# EAGLE design 16x2LCDShield (EAGLE 5.10)
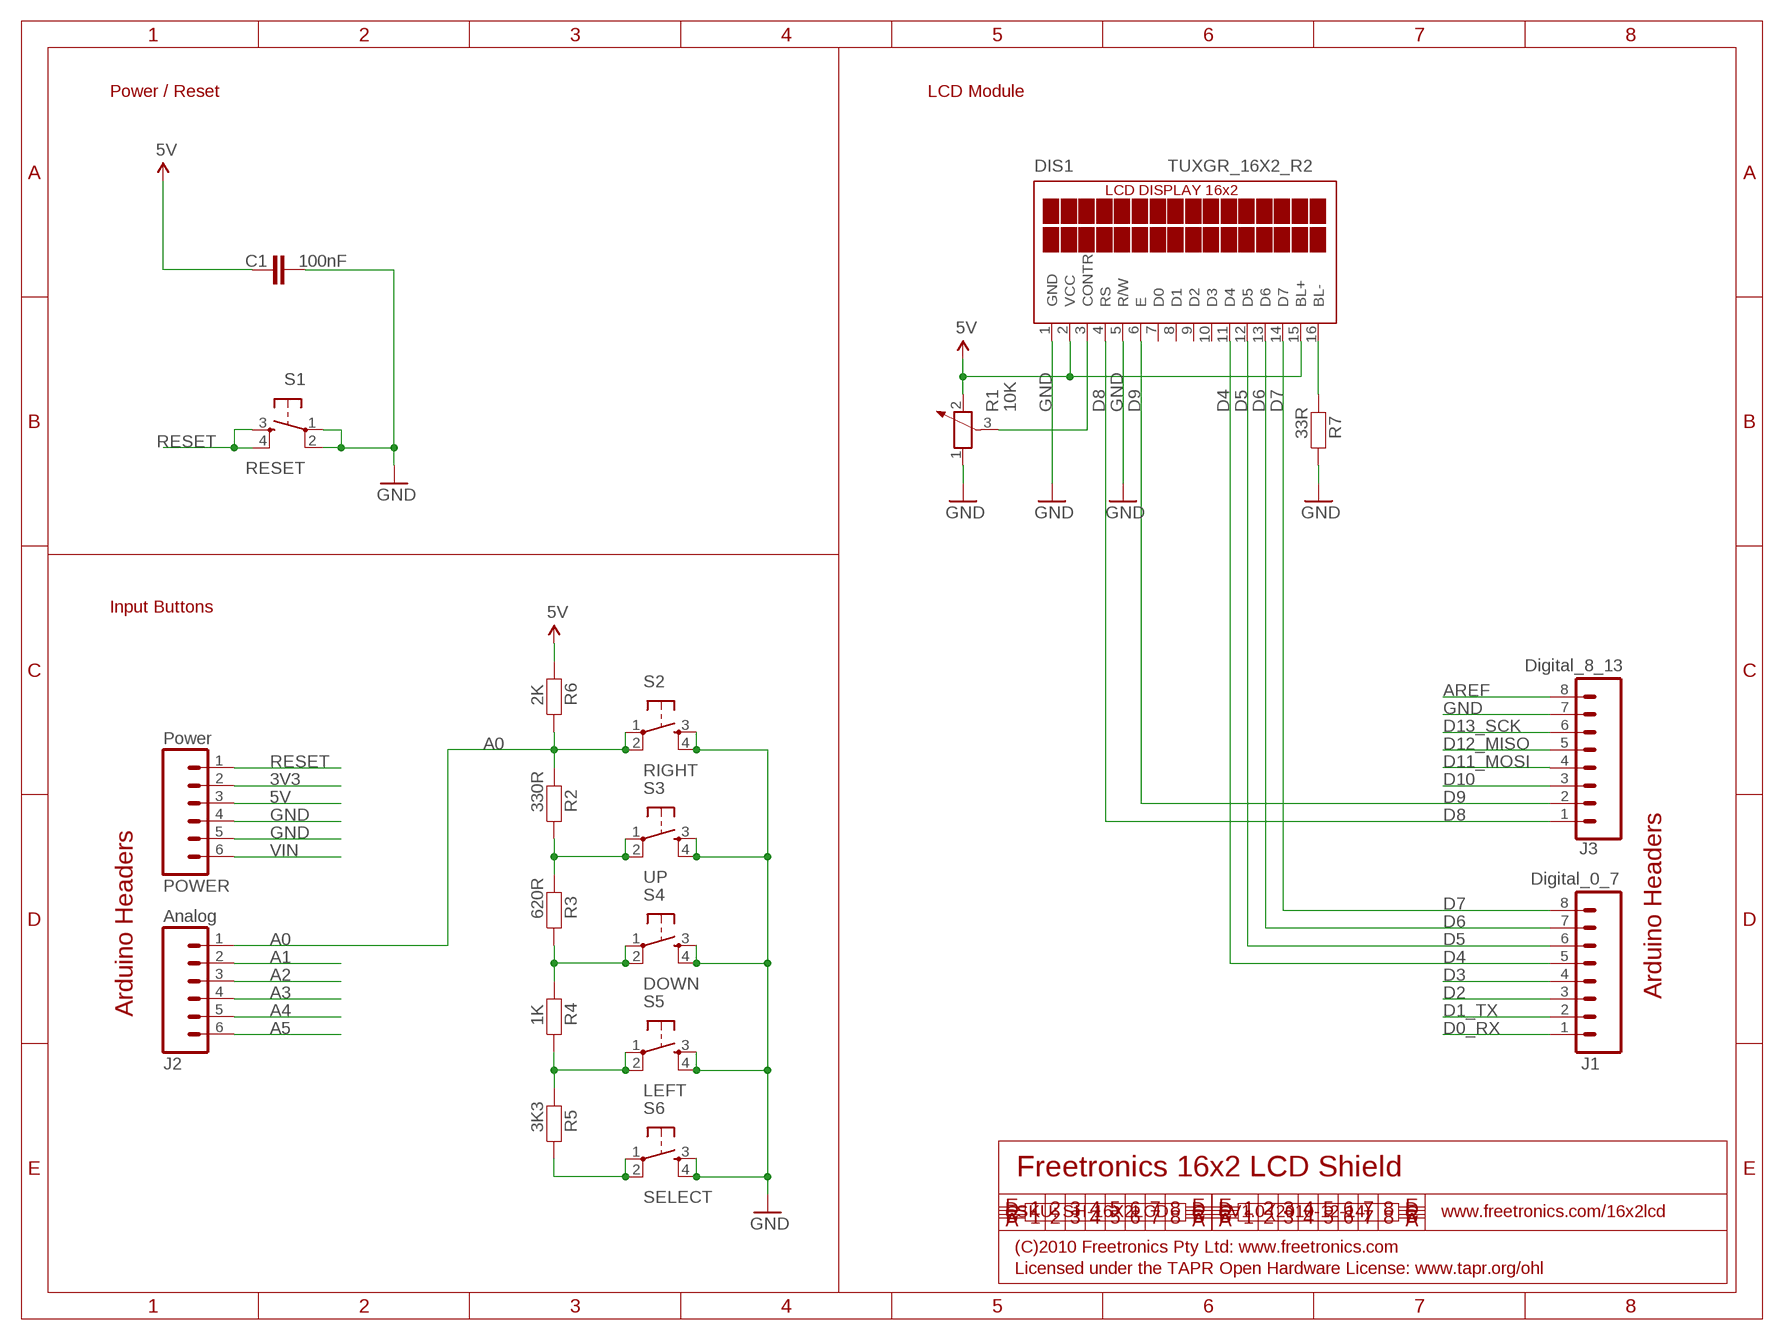
[diagram p0: schematic, sheet 1]

## Parts
C1  100nF  CAPPTH  [CAP-PTH-SMALL]
DIS1  TUXGR_16X2_R2  [TUXGR_16X2_R2]
J1  Digital_0_7  M08  [1X08]
J2  Analog  M06SIP  [1X06]
J3  Digital_8_13  M08  [1X08]
POWER  Power  M06SIP  [1X06]
R1  10K  POTENTIOMETER_PT-10  [PT-10]
R2  330R  FREETRONICS_RESISTORPTH2  [FREETRONICS_AXIAL-0.4]
R3  620R  FREETRONICS_RESISTORPTH2  [FREETRONICS_AXIAL-0.4]
R4  1K  FREETRONICS_RESISTORPTH2  [FREETRONICS_AXIAL-0.4]
R5  3K3  FREETRONICS_RESISTORPTH2  [FREETRONICS_AXIAL-0.4]
R6  2K  FREETRONICS_RESISTORPTH2  [FREETRONICS_AXIAL-0.4]
R7  33R  FREETRONICS_RESISTORPTH2  [FREETRONICS_AXIAL-0.4]
S1  RESET  TAC_SWITCHPTH  [TACTILE-PTH]
S2  RIGHT  TAC_SWITCHPTH  [TACTILE-PTH]
S3  UP  TAC_SWITCHPTH  [TACTILE-PTH]
S4  DOWN  TAC_SWITCHPTH  [TACTILE-PTH]
S5  LEFT  TAC_SWITCHPTH  [TACTILE-PTH]
S6  SELECT  TAC_SWITCHPTH  [TACTILE-PTH]

## Nets
3V3: POWER.2
5V: C1.1 DIS1.2(VCC) DIS1.15(BL+) POWER.3 R1.2 R6.P$2
A0: J2.1 R2.P$2 R6.P$1 S2.1 S2.2
A1: J2.2
A2: J2.3
A3: J2.4
A4: J2.5
A5: J2.6
AREF: J3.8
D0_RX: J1.1
D1_TX: J1.2
D2: J1.3
D3: J1.4
D4: DIS1.11(D4) J1.5
D5: DIS1.12(D5) J1.6
D6: DIS1.13(D6) J1.7
D7: DIS1.14(D7) J1.8
D8: DIS1.4(RS) J3.1
D9: DIS1.6(E) J3.2
D10: J3.3
D11_MOSI: J3.4
D12_MISO: J3.5
D13_SCK: J3.6
GND: C1.2 DIS1.1(GND) DIS1.5(R/W) J3.7 POWER.4 POWER.5 R1.1 R7.P$1 S1.1 S1.2 S2.3 S2.4 S3.3 S3.4 S4.3 S4.4 S5.3 S5.4 S6.3 S6.4
N$1: DIS1.3(CONTR) R1.3
N$2: R5.P$1 S6.1 S6.2
N$3: R4.P$1 R5.P$2 S5.1 S5.2
N$4: DIS1.16(BL-) R7.P$2
N$248: R3.P$1 R4.P$2 S4.1 S4.2
N$250: R2.P$1 R3.P$2 S3.1 S3.2
RESET: POWER.1 S1.3 S1.4
VIN: POWER.6
Unconnected: DIS1.7(D0) DIS1.8(D1) DIS1.9(D2) DIS1.10(D3)

## Notes on the sheet
- Power / Reset | LCD Module
- Input Buttons
- Arduino Headers
- Arduino Headers
- Freetronics 16x2 LCD Shield
- SKU: SH-16X2LCD | V1.0 (2010-12-14) | www.freetronics.com/16x2lcd
- (C)2010 Freetronics Pty Ltd: www.freetronics.com
- Licensed under the TAPR Open Hardware License: www.tapr.org/ohl

## Library data of the parts
C1 = freetronics:CAP: Capacitor Standard 0603 ceramic capacitor, and 0.1" leaded capacitor.
DIS1 = freetronics-jon:TUXGR_16X2_R2: Tuxgraphics LCD display 16x2 characters reflective, without background light Source: tuxgr_12x2_r2.pdf
J1 J3 = freetronics:M08: Header 8 Standard 8-pin 0.1" header. Use with straight break away headers (SKU : PRT-00116), right angle break away headers (PRT-00553), swiss pins (PRT-00743), machine pins (PRT-00117), and female headers (PRT-00115).
J2 POWER = freetronics:M06: Header 6 Standard 6-pin 0.1" header. Use with straight break away headers (SKU : PRT-00116), right angle break away headers (PRT-00553), swiss pins (PRT-00743), machine pins (PRT-00117), and female headers (PRT-00115). Molex polarized connector foot print use with SKU : PRT-08094 with associated crimp pins and housings. NOTES ON THE VARIANTS LOCK and LOCK_LONGPADS... This footprint was designed to help hold the alignment of a through-hole component (i.e. 6-pin header) while soldering it into place. You may notice that each hole has been shifted either up or down by 0.005 of an inch from it's more standard position (which is a perfectly straight line). This slight alteration caused the pins (the squares in the middle) to touch the edges of the holes. Because they are alternating, it causes a "brace" to hold the component in place. 0.005 has proven to be the perfect amount of "off-center" position when using our standard breakaway headers. Although looks a little odd when you look at the bare footprint, once you have a header in there, the alteration is very hard to notice. Also, if you push a header all the way into place, it is covered up entirely on the bottom side. This idea of altering the position of holes to aid alignment will be further integrated into the Sparkfun Library for other footprints. It can help hold any component with 3 or more connection pins.
R1 = rcl:POTENTIOMETER_: Potentiometer
R2-R7 = freetronics:FREETRONICS_RESISTOR: Resistor Basic schematic elements and footprints for 0603, 1206, and PTH 1/10th watt (small) resistors.
S1-S6 = freetronics:TAC_SWITCH: Momentary Switch Button commonly used for reset or general input. Spark Fun Electronics SKU : COM-00097

## Board
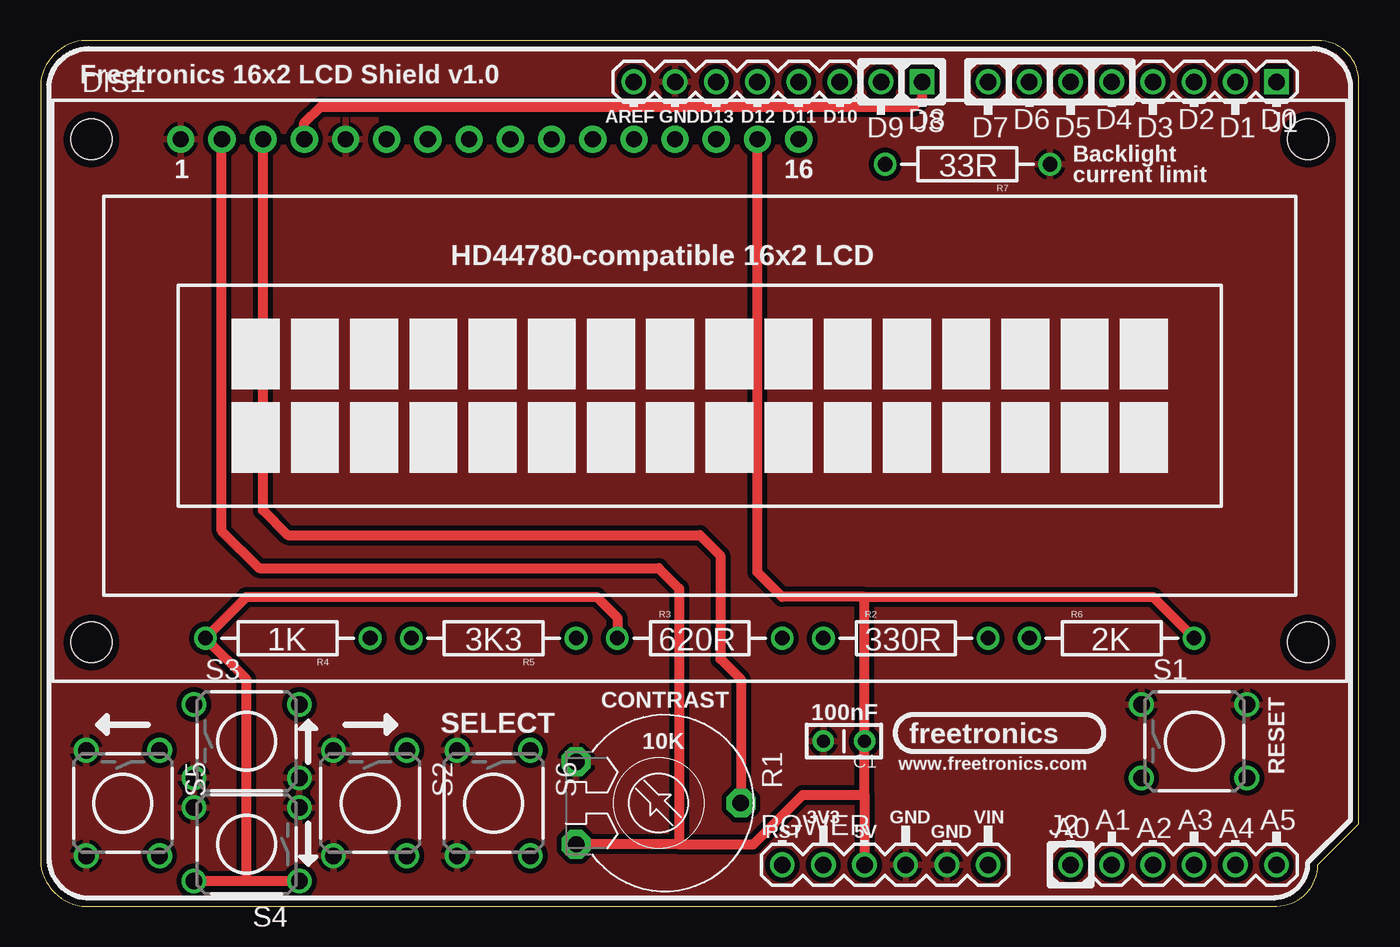
[diagram p1: board, top side]
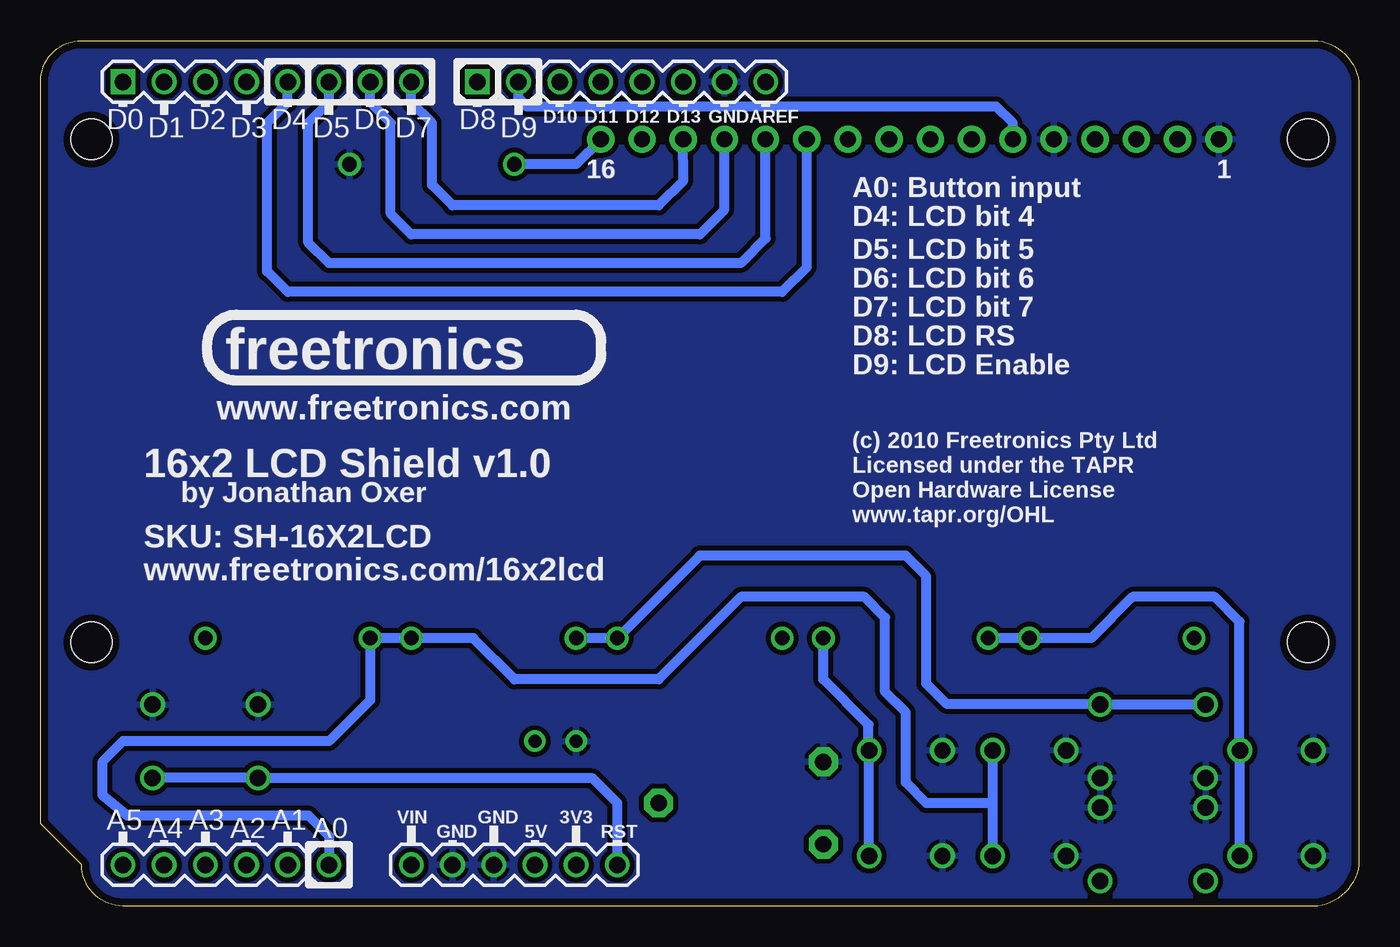
[diagram p2: board, bottom side, seen from below]

Size 81.28 x 53.34 mm. Coordinates in mm from the lower left corner, seen from the top.
Outline: 0,2.54 arc74 2.54,0 76.2,0 arc90 78.74,2.54 81.28,5.08 81.28,50.8 arc90 78.74,53.34 2.54,53.34 arc74 0,50.8 0,2.54
Copper layers (1*16): Top 0.035mm / dielectric 1.5mm / Bottom 0.035mm
Design rules "default *": minimum track width 10mil, minimum drill 24mil, track to track 12mil, track to pad 12mil, pad to pad 12mil, via to via 12mil, smd to smd 8mil, copper to edge 18mil, drill to drill 8mil, minimum pad ring 10mil, minimum via ring 8mil, stop-mask expansion 4mil, vias tented up to drill 0mil, thermal gap 10mil

### Footprints (pad centres in the part's own frame; a part is rotated, then mirrored left to right if it is on the bottom)
CAP-PTH-SMALL = drill 0.813 round: 1 0,0; 2 2.54,0
TUXGR_16X2_R2 = drill 1 pad 1.676 round: 1 -32,15.5; 2 -29.46,15.5; 3 -26.92,15.5; 4 -24.38,15.5; 5 -21.84,15.5; 6 -19.3,15.5; 7 -16.76,15.5; 8 -14.22,15.5; 9 -11.68,15.5; 10 -9.14,15.5; 11 -6.6,15.5; 12 -4.06,15.5; 13 -1.52,15.5; 14 1.02,15.5; 15 3.56,15.5; 16 6.1,15.5 | hole 2.5: -37.5,-15.5; 37.5,-15.5; -37.5,15.5; 37.5,15.5
1X08 = drill 1.016 square: 1 0,0 | drill 1.016 round: 2 2.54,0; 3 5.08,0; 4 7.62,0; 5 10.16,0; 6 12.7,0; 7 15.24,0; 8 17.78,0
1X06 = drill 1.016 round: 1 0,0; 2 2.54,0; 3 5.08,0; 4 7.62,0; 5 10.16,0; 6 12.7,0
PT-10 = drill 1.016 pad 1.778 octagon: 1 -2.54,-5.08; 2 2.54,-5.08; 3 0,5.08
FREETRONICS_AXIAL-0.4 = drill 0.9 round: P$1 -5.08,0; P$2 5.08,0
TACTILE-PTH = drill 1.016 round: 1 -3.251,2.261; 2 3.251,2.261; 3 -3.251,-2.261; 4 3.251,-2.261

### Placement (x,y rotation side)
C1  50.8,10.16 180 top
DIS1  40.64,31.75 0 top
J1  76.2,50.8 180 top
J2  63.5,2.54 0 top
J3  54.36,50.8 180 top
POWER  45.72,2.54 0 top
R1  38.1,6.35 270 top
R2  53.34,16.51 0 top
R3  40.64,16.51 0 top
R4  15.24,16.51 180 top
R5  27.94,16.51 180 top
R6  66.04,16.51 0 top
R7  57.15,45.72 180 top
S1  71.12,10.16 0 top
S2  20.32,6.35 270 top
S3  12.7,10.16 0 top
S4  12.7,3.81 180 top
S5  5.08,6.35 270 top
S6  27.94,6.35 270 top

### Tracks (layer width: path | path; a pad name or v marks a point on that pad's centre or on a via)
5V
  Top 0.406: DIS1.2
  Top 0.61: 50.8,19.05 C1.1 50.8,6.86 | 50.8,19.05 68.58,19.05 R6.P$2 | 50.8,19.05 45.72,19.05 44.2,20.57 44.2,21.84 DIS1.15 | 39.37,3.81 R1.2 | 39.37,3.81 43.94,3.81 46.99,6.86 50.8,6.86 | DIS1.2 11.18,23.11 13.46,20.83 38.1,20.83 39.37,19.56 39.37,3.81 | 50.8,6.86 POWER.3
A0
  Bottom 0.61: S2.2 22.58,6.35 | 22.58,6.35 S2.1 | 22.58,6.35 26.67,6.35 27.94,7.62 27.94,11.94 29.21,13.21 29.21,17.78 30.48,19.05 38.1,19.05 43.18,13.97 52.07,13.97 54.61,16.51 R2.P$2 R6.P$1 60.96,12.7 63.5,10.16 76.2,10.16 77.47,8.89 77.47,6.86 75.95,5.59 64.77,5.59 63.5,4.32 J2.1
D4
  Bottom 0.61: J1.5 66.04,49.53 67.31,48.26 67.31,39.12 66.04,37.85 35.56,37.85 34.04,39.37 DIS1.11
D5
  Bottom 0.61: J1.6 63.5,49.53 64.77,48.26 64.77,40.89 63.5,39.62 38.1,39.62 36.58,41.15 DIS1.12
D6
  Bottom 0.61: J1.7 60.96,49.53 59.69,48.26 59.69,42.67 58.42,41.4 40.64,41.4 39.12,42.93 DIS1.13
D7
  Bottom 0.61: J1.8 58.42,49.53 57.15,48.26 57.15,44.45 55.88,43.18 43.18,43.18 41.66,44.7 DIS1.14
D8
  Top 0.61: DIS1.4 16.26,48.26 17.27,49.28 53.85,49.28 54.36,49.78 J3.1
D9
  Bottom 0.61: DIS1.6 21.34,48.26 22.35,49.28 51.31,49.28 51.82,49.78 J3.2
GND
  pour Bottom: 0,50.8 arc-74 2.54,53.34 78.74,53.34 arc-74 81.28,50.8 81.28,5.08 78.74,2.54 arc-74 76.2,0 2.54,0 arc-74 0,2.54
  pour Top: 0,50.8 arc-74 2.54,53.34 78.74,53.34 arc-74 81.28,50.8 81.28,5.08 78.74,2.54 arc-74 76.2,0 2.54,0 arc-74 0,2.54
N$1
  Top 0.61: R1.3 43.18,13.97 41.91,15.24 41.91,21.59 40.64,22.86 15.24,22.86 13.72,24.38 DIS1.3
N$2
  Bottom 0.406: 30.2,9.88 30.23,9.91
  Bottom 0.61: S6.2 S6.1 30.2,9.88 | R5.P$1 33.02,13.97 30.23,11.18 30.23,9.91
N$3
  Bottom 0.406: S5.1 7.37,9.91
  Bottom 0.61: R5.P$2 R4.P$1 16.51,16.51 13.97,19.05 8.89,19.05 7.37,17.53 7.37,9.91 | S5.2 S5.1
N$4
  Bottom 0.61: DIS1.16 48.26,45.72 R7.P$2
N$248
  Top 0.61: R3.P$1 35.56,17.78 34.29,19.05 12.7,19.05 R4.P$2 12.7,13.97 12.7,1.55 | S4.2 12.7,1.55 | 12.7,1.55 S4.1
N$250
  Bottom 0.406: S3.2 16.26,12.45
  Bottom 0.61: S3.1 S3.2 | R2.P$1 R3.P$2 40.64,21.59 27.94,21.59 26.67,20.32 26.67,13.72 25.4,12.45 16.26,12.45
RESET
  Bottom 0.61: S1.4 S1.3 67.33,7.9 67.31,7.87 47.24,7.87 45.72,6.35 POWER.1

### Text on the board
tPlace: Freetronics 16x2 LCD Shield v1.0 | AREF | GND | D13 | D12 | D11 | D10 | D8 | D6 | D4 | D2 | D0 | D9 | D7 | D5 | D3 | D1 | Backlight | 1 | 16 | current limit | HD44780-compatible 16x2 LCD | CONTRAST | SELECT | 100nF | 10K | freetronics | www.freetronics.com | RESET | 3V3 | GND | VIN | A1 | A3 | A5 | RST | 5V | GND | A0 | A2 | A4
bPlace: AREF | GND | D13 | D12 | D11 | D10 | D8 | D6 | D4 | D2 | D0 | D9 | D7 | D5 | D3 | D1 | 1 | 16 | A0: Button input | D4: LCD bit 4 | D5: LCD bit 5 | D6: LCD bit 6 | D7: LCD bit 7 | D8: LCD RS | D9: LCD Enable | freetronics | www.freetronics.com | (c) 2010 Freetronics Pty Ltd | Licensed under the TAPR | 16x2 LCD Shield v1.0 | Open Hardware License | by Jonathan Oxer | www.tapr.org/OHL | SKU: SH-16X2LCD | www.freetronics.com/16x2lcd | 3V3 | GND | VIN | A1 | A3 | A5 | RST | 5V | GND | A0 | A2 | A4